# Altium schematic sheet connectors(temp).SchDoc
size A; SheetNumber: 1; SheetTotal: 4
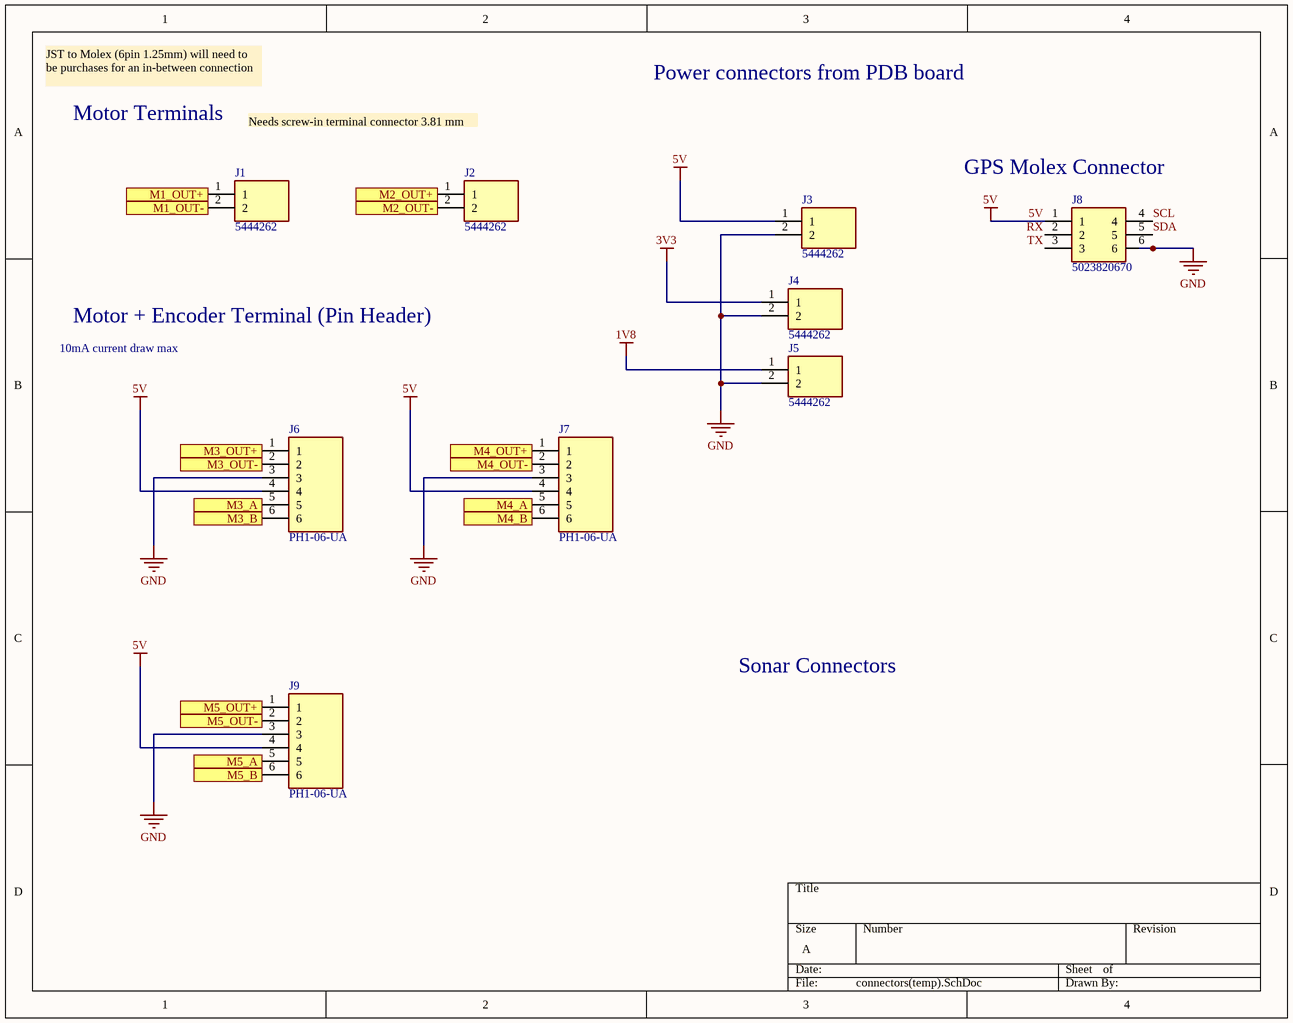
[diagram p0: connectors(temp).SchDoc]

## Parts
J1  5444262  [SHDR2W80P0X381_1X2_901X920X740P]
J2  5444262  [SHDR2W80P0X381_1X2_901X920X740P]
J3  5444262  [SHDR2W80P0X381_1X2_901X920X740P]
J4  5444262  [SHDR2W80P0X381_1X2_901X920X740P]
J5  5444262  [SHDR2W80P0X381_1X2_901X920X740P]
J6  PH1-06-UA  [HDRV6W64P0X254_1X6_1524X250X952P]
J7  PH1-06-UA  [HDRV6W64P0X254_1X6_1524X250X952P]
J8  5023820670  [5023820670]
J9  PH1-06-UA  [HDRV6W64P0X254_1X6_1524X250X952P]

## Ports
M1_OUT+ (in), M1_OUT- (in), M2_OUT+ (in), M2_OUT- (in), M3_A (out), M3_B (out), M3_OUT+ (in), M3_OUT- (in), M4_A (out), M4_B (out), M4_OUT+ (in), M4_OUT- (in), M5_A (out), M5_B (out), M5_OUT+ (in), M5_OUT- (in)

## Nets
1V8: J5.1
3V3: J4.1
5V: J3.1 J6.4 J7.4 J8.1 J9.4
GND: J3.2 J4.2 J5.2 J6.3 J7.3 J8.6 J9.3
M1_OUT+: J1.1 ; port M1_OUT+
M1_OUT-: J1.2 ; port M1_OUT-
M2_OUT+: J2.1 ; port M2_OUT+
M2_OUT-: J2.2 ; port M2_OUT-
M3_A: J6.5 ; port M3_A
M3_B: J6.6 ; port M3_B
M3_OUT+: J6.1 ; port M3_OUT+
M3_OUT-: J6.2 ; port M3_OUT-
M4_A: J7.5 ; port M4_A
M4_B: J7.6 ; port M4_B
M4_OUT+: J7.1 ; port M4_OUT+
M4_OUT-: J7.2 ; port M4_OUT-
M5_A: J9.5 ; port M5_A
M5_B: J9.6 ; port M5_B
M5_OUT+: J9.1 ; port M5_OUT+
M5_OUT-: J9.2 ; port M5_OUT-
RX: J8.2
SCL: J8.4
SDA: J8.5
TX: J8.3

## Notes on the sheet
- JST to Molex (6pin 1.25mm) will need to be purchases for an in-between connection
- Power connectors from PDB board
- Motor Terminals
- Needs screw-in terminal connector 3.81 mm connector
- (near J8) GPS Molex Connector
- 10mA current draw max
- Motor + Encoder Terminal (Pin Header)
- Sonar Connectors

## Library data of the parts
J1-J5 = 5444262: Connector; Manufacturer_Name: Phoenix Contact; Datasheet Link: https://datasheet.datasheetarchive.com/originals/distributors/Datasheets-DGA25/1829481.pdf; Height: 7.4mm; Manufacturer_Part_Number: 5444262; Mouser Part Number: 651-5444262; Mouser Price/Stock: https://www.mouser.co.uk/ProductDetail/Phoenix-Contact/5444262?qs=9Y9qB%2FCsC3lS%2FxAVKTDcmQ%3D%3D; Arrow Part Number: 5444262; Arrow Price/Stock: https://www.arrow.com/en/products/5444262/phoenix-contact?region=nac
J6 J7 J9 = PH1-06-UA: Connector; Manufacturer_Name: Adam Tech; Datasheet Link: https://datasheet.datasheetarchive.com/originals/distributors/Datasheets_SAMA/22522227e000bb8d8f26a3580c1bb98b.pdf; Height: 9.516mm; Manufacturer_Part_Number: PH1-06-UA; Arrow Part Number: PH1-06-UA; Arrow Price/Stock: https://www.arrow.com/en/products/ph1-06-ua/adam-tech?region=nac
J8 = 5023820670: Connector; Manufacturer_Name: Molex; Datasheet Link: https://www.molex.com/pdm_docs/sd/5023820870_sd.pdf; Height: 4.55mm; Manufacturer_Part_Number: 5023820670; Arrow Part Number: 5023820670; Arrow Price/Stock: https://www.arrow.com/en/products/502382-0670/molex